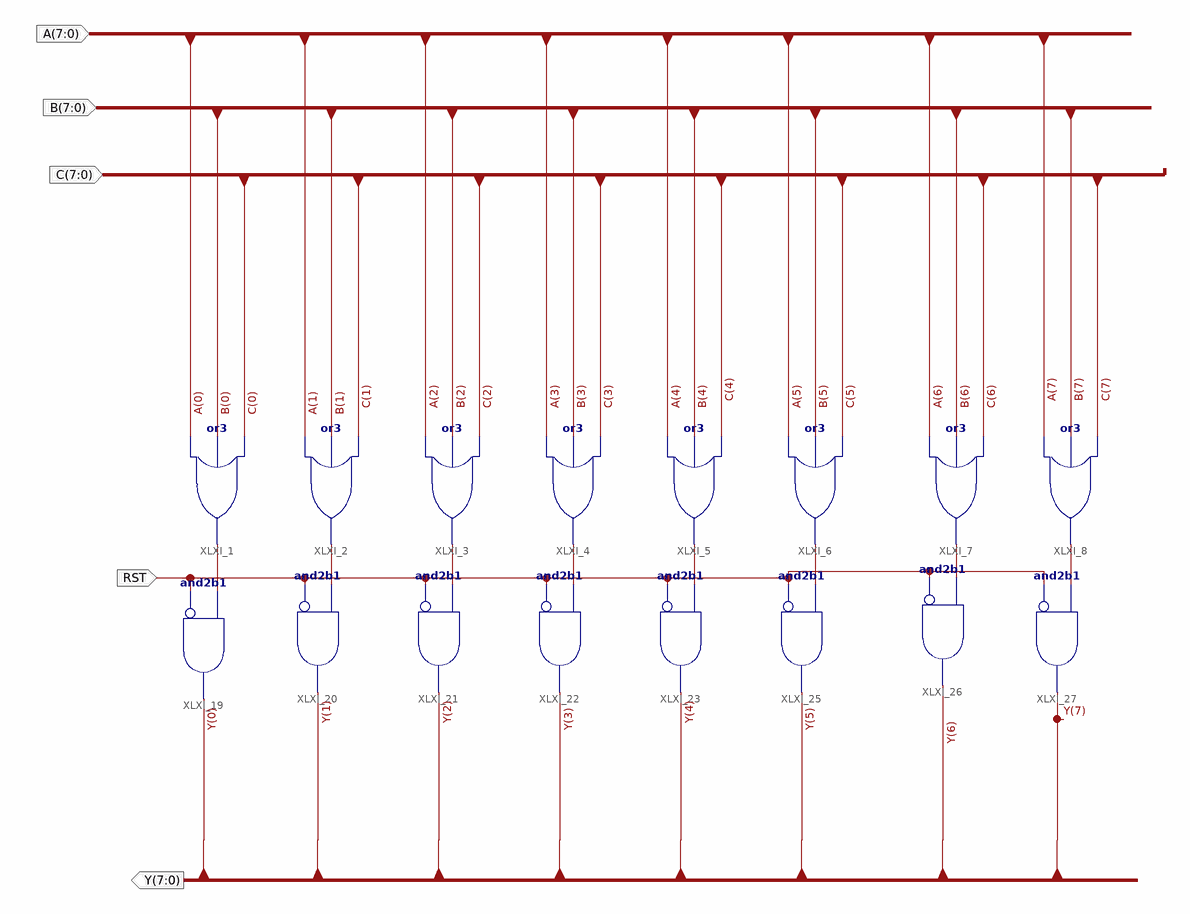
[diagram p0: schematic sheet 1]
// Xilinx ISE schematic or3_8bits.sch (artix7) as structural Verilog: 16 symbols, 5 ports
module or3_8bits (
  input  [7:0] A,
  input  RST,
  input  [7:0] B,
  input  [7:0] C,
  output [7:0] Y
);

  wire XLXN_99, XLXN_100, XLXN_101, XLXN_102, XLXN_103, XLXN_104, XLXN_105, XLXN_106;

  or XLXI_8 (XLXN_106, A[7], B[7], C[7]);
  or XLXI_7 (XLXN_105, A[6], B[6], C[6]);
  or XLXI_6 (XLXN_104, A[5], B[5], C[5]);
  or XLXI_5 (XLXN_103, A[4], B[4], C[4]);
  or XLXI_4 (XLXN_102, A[3], B[3], C[3]);
  or XLXI_3 (XLXN_101, A[2], B[2], C[2]);
  or XLXI_2 (XLXN_100, A[1], B[1], C[1]);
  or XLXI_1 (XLXN_99, A[0], B[0], C[0]);
  and XLXI_19 (Y[0], ~RST, XLXN_99);  // and2b1
  and XLXI_20 (Y[1], ~RST, XLXN_100);  // and2b1
  and XLXI_21 (Y[2], ~RST, XLXN_101);  // and2b1
  and XLXI_22 (Y[3], ~RST, XLXN_102);  // and2b1
  and XLXI_23 (Y[4], ~RST, XLXN_103);  // and2b1
  and XLXI_25 (Y[5], ~RST, XLXN_104);  // and2b1
  and XLXI_26 (Y[6], ~RST, XLXN_105);  // and2b1
  and XLXI_27 (Y[7], ~RST, XLXN_106);  // and2b1
endmodule
